# Altium schematic sheet S7V10Logger.SchDoc
size A3
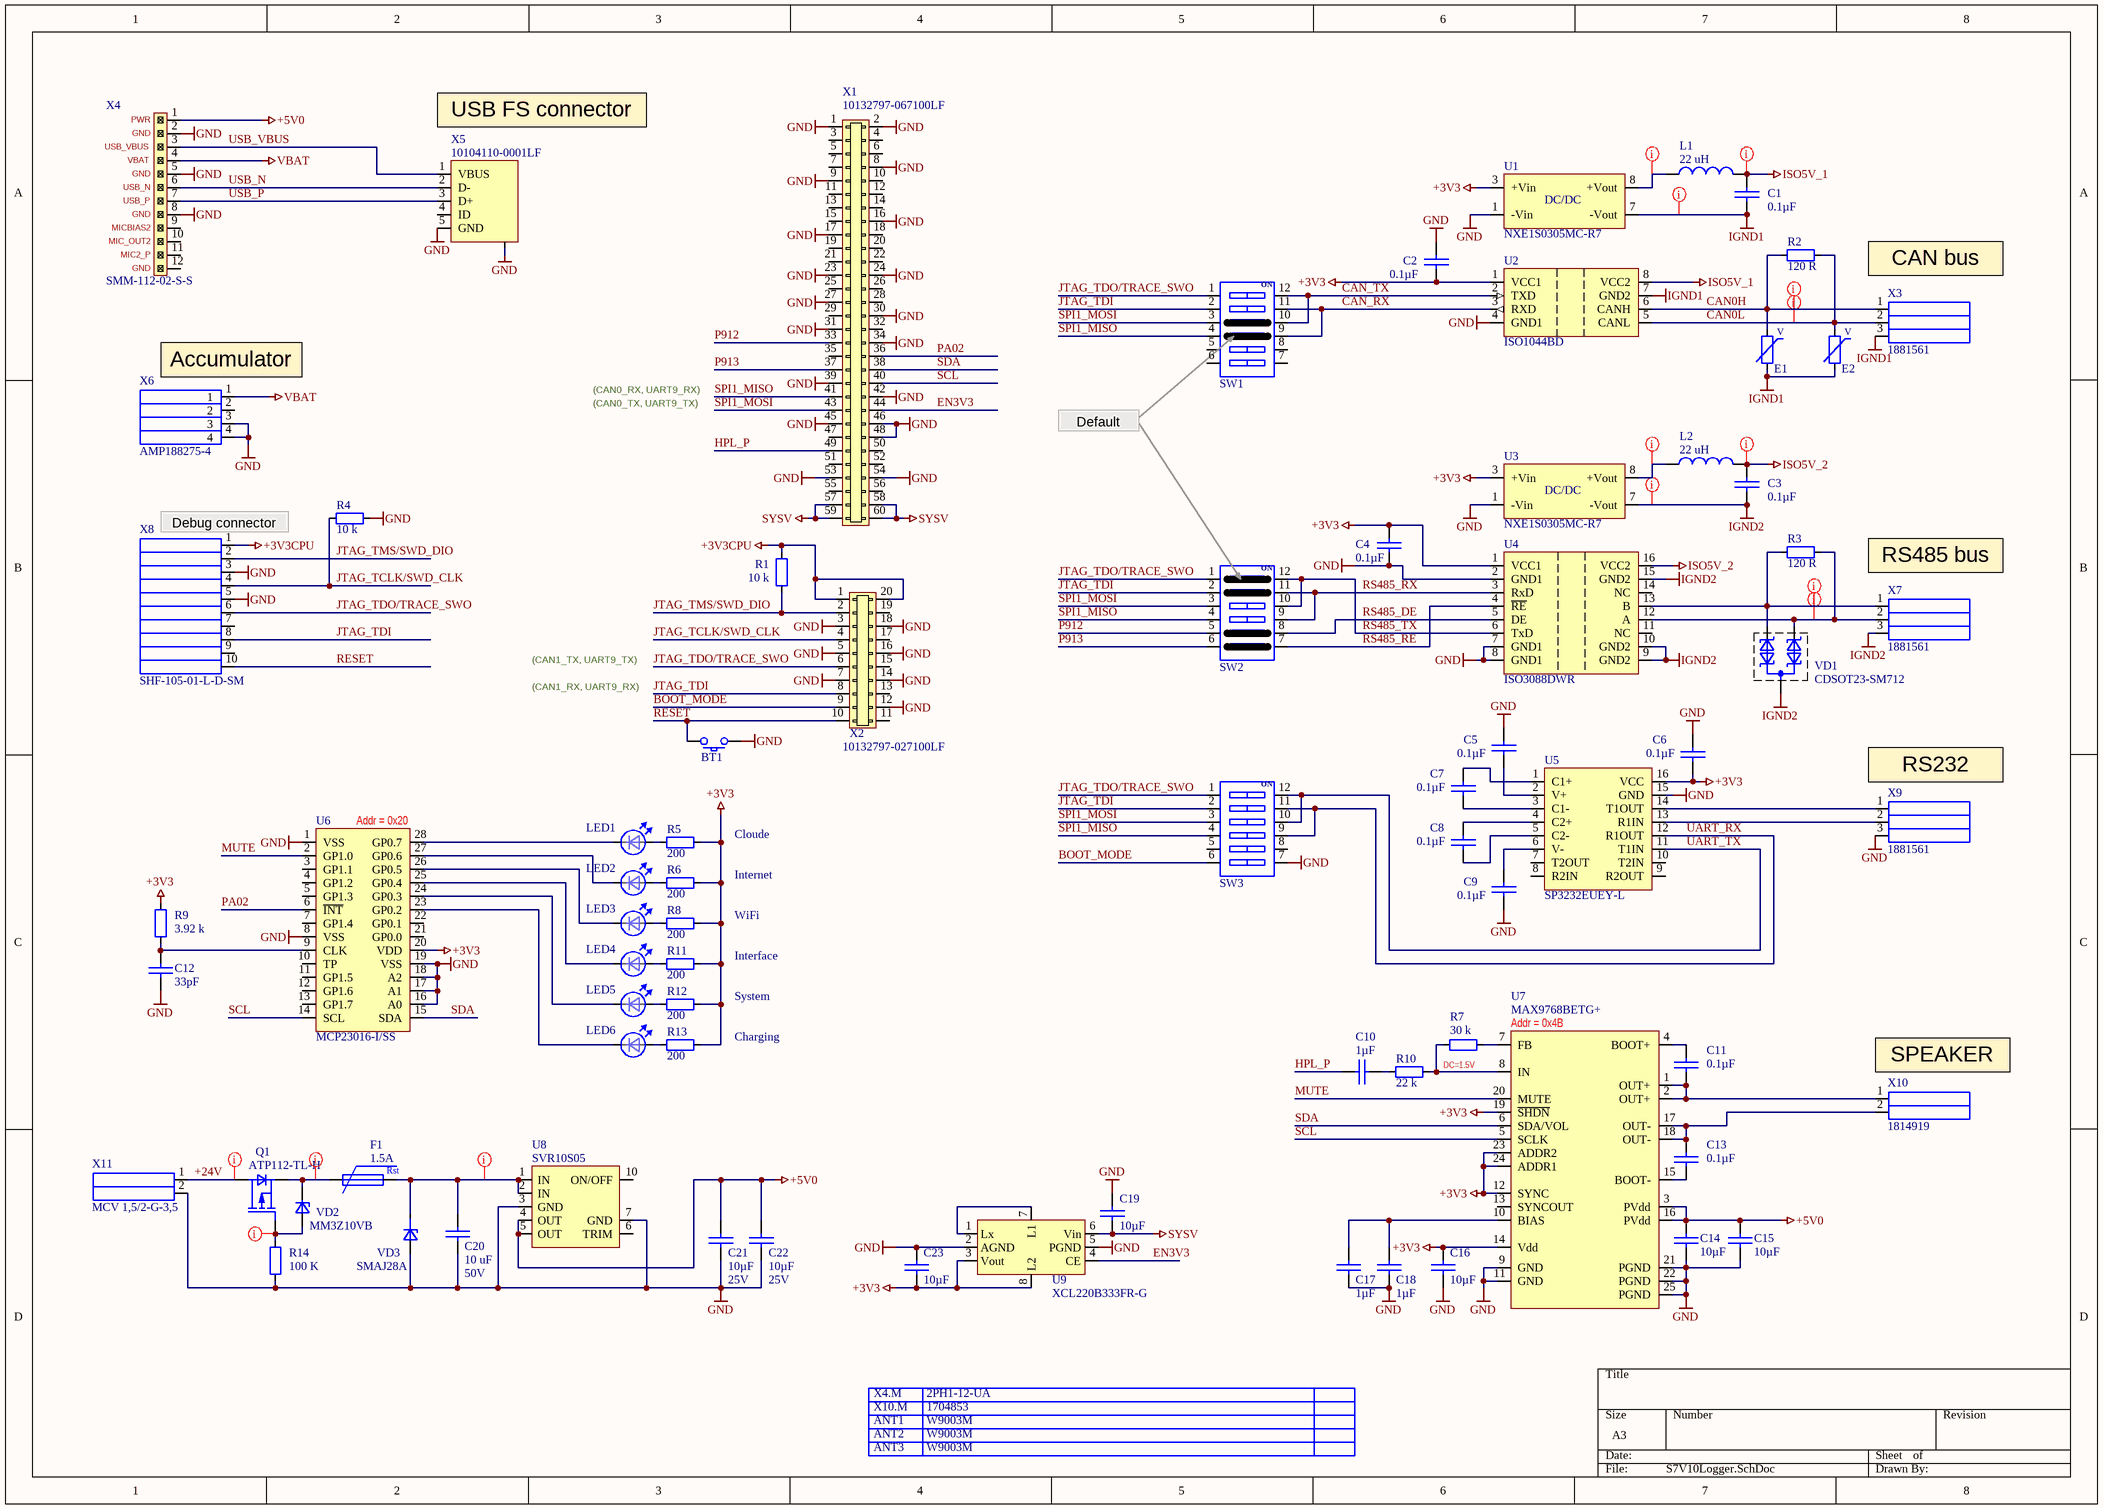
[diagram p0: S7V10Logger.SchDoc]

## Parts
ANT1  W9003M
ANT2  W9003M
ANT3  W9003M
BT1  B3U-3000P  [B3U-3000P]  (value not drawn)
C1  value 0.1µF  [0603 CAP]  (hidden comment: CL10B104KA8NNND)
C2  value 0.1µF  [0603 CAP]  (hidden comment: CL10B104KA8NNND)
C3  value 0.1µF  [0603 CAP]  (hidden comment: CL10B104KA8NNND)
C4  value 0.1µF  [0603 CAP]  (hidden comment: CL10B104KA8NNND)
C5  value 0.1µF  [0603 CAP]  (hidden comment: CL10B104KA8NNND)
C6  value 0.1µF  [0603 CAP]  (hidden comment: CL10B104KA8NNND)
C7  value 0.1µF  [0603 CAP]  (hidden comment: CL10B104KA8NNND)
C8  value 0.1µF  [0603 CAP]  (hidden comment: CL10B104KA8NNND)
C9  value 0.1µF  [0603 CAP]  (hidden comment: CL10B104KA8NNND)
C10  value 1µF  [0603 CAP]  (hidden comment: Capacitor)
C11  value 0.1µF  [0603 CAP]  (hidden comment: CL10B104KA8NNND)
C12  value 33pF  [0603 CAP]  (hidden comment: Capacitor)
C13  value 0.1µF  [0603 CAP]  (hidden comment: CL10B104KA8NNND)
C14  value 10µF  [0805 CAP]  (hidden comment: Capacitor)
C15  value 10µF  [0805 CAP]  (hidden comment: Capacitor)
C16  value 10µF  [0805 CAP]  (hidden comment: Capacitor)
C17  value 1µF  [0603 CAP]  (hidden comment: Capacitor)
C18  value 1µF  [0603 CAP]  (hidden comment: Capacitor)
C19  value 10µF  [0805 CAP]  (hidden comment: Capacitor)
C20  value 10 uF  Voltage: 50V  [3225[1210]]  (hidden comment: GRM32DF51H106ZA01L)
C21  value 10µF  Voltage - Rated: 25V  [1206 CAP]  (hidden comment: Capacitor)
C22  value 10µF  Voltage - Rated: 25V  [1206 CAP]  (hidden comment: Capacitor)
C23  value 10µF  [0805 CAP]  (hidden comment: Capacitor)
E1  823 560 505 60  [0603]  (value not drawn)
E2  823 560 505 60  [0603]  (value not drawn)
F1  value 1.5A  [2920 (7351 Metric)]  (hidden comment: 0ZCF0075AF2C)
L1  value 22 uH  [8200 Series Murata]  (hidden comment: 82223C)
L2  value 22 uH  [8200 Series Murata]  (hidden comment: 82223C)
LED1  SSL-LXA228SIC-TR31  [SSL-LXA228SIC-TR31]  (value not drawn)
LED2  SSL-LXA228SIC-TR31  [SSL-LXA228SIC-TR31]  (value not drawn)
LED3  SSL-LXA228SIC-TR31  [SSL-LXA228SIC-TR31]  (value not drawn)
LED4  SSL-LXA228SIC-TR31  [SSL-LXA228SIC-TR31]  (value not drawn)
LED5  SSL-LXA228SIC-TR31  [SSL-LXA228SIC-TR31]  (value not drawn)
LED6  SSL-LXA228SIC-TR31  [SSL-LXA228SIC-TR31]  (value not drawn)
Q1  ATP112-TL-H  [ATPAK, On Semiconductor]
R1  value 10 k  [0603]  (hidden comment: Resistor)
R2  value 120 R  [0603]  (hidden comment: RL0603E120-1)
R3  value 120 R  [0603]  (hidden comment: RL0603E120-1)
R4  value 10 k  [0603]  (hidden comment: Resistor)
R5  value 200  [0603]  (hidden comment: Resistor)
R6  value 200  [0603]  (hidden comment: Resistor)
R7  value 30 k  [0603]  (hidden comment: Resistor)
R8  value 200  [0603]  (hidden comment: Resistor)
R9  value 3.92 k  [0603]  (hidden comment: Resistor)
R10  value 22 k  [0603]  (hidden comment: Resistor)
R11  value 200  [0603]  (hidden comment: Resistor)
R12  value 200  [0603]  (hidden comment: Resistor)
R13  value 200  [0603]  (hidden comment: Resistor)
R14  value 100 K  [0603]  (hidden comment: RL0603K100-1)
SW1  CHS-06TA  [CHS-06TA Copal Electronics]  (value not drawn)
SW2  CHS-06TA  [CHS-06TA Copal Electronics]  (value not drawn)
SW3  CHS-06TA  [CHS-06TA Copal Electronics]  (value not drawn)
U1  NXE1S0305MC-R7  [NXE1 Murata]
U2  ISO1044BD  [SO-8]
U3  NXE1S0305MC-R7  [NXE1 Murata]
U4  ISO3088DWR  [SO-G16/D10.4]
U5  SP3232EUEY-L  [TSOP65P640-16AM]
U6  MCP23016-I/SS  [MICROCHIP_SSOP28_0.65_5.3]
U7  MAX9768BETG+  [THIN QFN 24 with via]
U8  SVR10S05  [SVR10S05]
U9  XCL220B333FR-G  [XCL219]
VD1  CDSOT23-SM712  [SOT23]
VD2  MM3Z10VB  [SOD323]
VD3  SMAJ28A  [SMA]
X1  10132797-067100LF  [10132797-067100LF]
X2  10132797-027100LF  [10132797-027100LF]
X3  1881561  [1881561]
X4  SMM-112-02-S-S  [SMM-112-02-S-S]
X4.M  2PH1-12-UA
X5  10104110-0001LF  [FCI micro USB B receptacle SMD]
X6  AMP188275-4  [AMP188275-4]
X7  1881561  [1881561]
X8  SHF-105-01-L-D-SM  [SHF-105-01-L-D-SM]
X9  1881561  [1881561]
X10  1814919  [1814919]
X10.M  1704853
X11  MCV 1,5/2-G-3,5  [mcv1.5-2-g_3.5 Green  + MC 1,5 2-ST-3,5 - 1840366]

## Nets
+3V3: C2.1 C4.2 C6.1 C16.1 C23.2 R5.2 R6.2 R8.2 R9.2 R11.2 R12.2 R13.2 U1.3(+Vin) U2.1(VCC1) U3.3(+Vin) U4.1(VCC1) U5.16(VCC) U6.20(VDD) U7.12(SYNC) U7.14(Vdd) U7.19(~{SHDN}) U7.23(ADDR2) U7.24(ADDR1) U9.3(Vout) U9.8(L2)
+3V3CPU: R1.2 X2.1 X2.20 X8.1
+5V0: C14.1 C15.1 C21.1 C22.1 U7.3(PVdd) U7.16(PVdd) U8.4(OUT) U8.5(OUT) X4.1
GND: BT1.1 C2.2 C4.1 C5.2 C6.2 C9.1 C12.2 C14.2 C15.2 C16.2 C17.2 C18.2 C19.1 C20.2 C21.2 C22.2 C23.1 R4.2 R14.1 SW3.7 U1.1(-Vin) U2.4(GND1) U3.1(-Vin) U4.2(GND1) U4.7(GND1) U4.8(GND1) U5.15(GND) U6.1(VSS) U6.8(VSS) U6.16(A0) U6.17(A1) U6.18(A2) U6.19(VSS) U7.9(GND) U7.11(GND) U7.21(PGND) U7.22(PGND) U7.25(PGND) U8.3(GND) U8.7(GND) U9.2(AGND) U9.5(PGND) VD3.2 X1.1 X1.2 X1.8 X1.9 X1.16 X1.17 X1.23 X1.24 X1.27 X1.30 X1.31 X1.34 X1.39 X1.42 X1.45 X1.46 X1.48 X1.53 X1.54 X2.3 X2.5 X2.7 X2.12 X2.14 X2.16 X2.18 X4.2 X4.5 X4.8 X5.5(GND) X5.G1(CASE) X6.3 X6.4 X8.3 X8.5 X9.3 X11.2
IGND1: C1.1 E1.1 E2.1 U1.7(-Vout) U2.7(GND2) X3.3
IGND2: C3.1 U3.7(-Vout) U4.9(GND2) U4.10(GND2) U4.15(GND2) VD1.3 X7.3
ISO5V_1: C1.2 L1.2 U2.8(VCC2)
ISO5V_2: C3.2 L2.2 U4.16(VCC2)
SYSV: C19.2 U9.6(Vin) X1.57 X1.58 X1.59 X1.60
VBAT: X4.4 X6.1
+24V: Q1.4(D) X11.1
BOOT_MODE: SW3.6 X2.9
CAN0H: E1.2 R2.2 U2.6(CANH) X3.1
CAN0L: E2.2 R2.1 U2.5(CANL) X3.2
CAN_RX: SW1.9 SW1.11 U2.3(RXD)
CAN_TX: SW1.10 SW1.12 U2.2(TXD)
EN3V3: U9.4(CE) X1.44
HPL_P: C10.1 X1.49
JTAG_TCLK/SWD_CLK: R4.1 X2.4 X8.4
JTAG_TDI: SW1.2 SW2.2 SW3.2 X2.8 X8.8
JTAG_TDO/TRACE_SWO: SW1.1 SW2.1 SW3.1 X2.6 X8.6
JTAG_TMS/SWD_DIO: R1.1 X2.2 X8.2
MUTE: U6.2(GP1.0) U7.20(MUTE)
P912: SW2.5 X1.33
P913: SW2.6 X1.37
PA02: U6.6(~{INT}) X1.36
RESET: BT1.2 X2.10 X8.10
RS485_DE: SW2.8 U4.5(DE)
RS485_RE: SW2.7 U4.4(~{RE})
RS485_RX: SW2.9 SW2.11 U4.3(RxD)
RS485_TX: SW2.10 SW2.12 U4.6(TxD)
SCL: U6.14(SCL) U7.5(SCLK) X1.40
SDA: U6.15(SDA) U7.6(SDA/VOL) X1.38
SPI1_MISO: SW1.4 SW2.4 SW3.4 X1.41
SPI1_MOSI: SW1.3 SW2.3 SW3.3 X1.43
UART_RX: SW3.9 SW3.11 U5.12(R1OUT)
UART_TX: SW3.10 SW3.12 U5.11(T1IN)
USB_N: X4.6 X5.2(D-)
USB_P: X4.7 X5.3(D+)
USB_VBUS: X4.3 X5.1(VBUS)
NetC5_1: C5.1 U5.2(V+)
NetC7_1: C7.1 U5.3(C1-)
NetC7_2: C7.2 U5.1(C1+)
NetC8_1: C8.1 U5.5(C2-)
NetC8_2: C8.2 U5.4(C2+)
NetC9_2: C9.2 U5.6(V-)
NetC10_2: C10.2 R10.1
NetC11_1: C11.1 U7.1(OUT+) U7.2(OUT+) X10.1
NetC11_2: C11.2 U7.4(BOOT+)
NetC12_1: C12.1 R9.1 U6.9(CLK)
NetC13_1: C13.1 U7.15(BOOT-)
NetC13_2: C13.2 U7.17(OUT-) U7.18(OUT-) X10.2
NetC17_1: C17.1 C18.1 U7.10(BIAS)
NetC20_1: C20.1 F1.2 U8.1(IN) U8.2(IN) VD3.1
NetF1_1: F1.1 Q1.3(S) VD2.2
NetL1_1: L1.1 U1.8(+Vout)
NetL2_1: L2.1 U3.8(+Vout)
NetLED1_1: LED1.1 R5.1
NetLED1_2: LED1.2 U6.28(GP0.7)
NetLED2_1: LED2.1 R6.1
NetLED2_2: LED2.2 U6.27(GP0.6)
NetLED3_1: LED3.1 R8.1
NetLED3_2: LED3.2 U6.26(GP0.5)
NetLED4_1: LED4.1 R11.1
NetLED4_2: LED4.2 U6.25(GP0.4)
NetLED5_1: LED5.1 R12.1
NetLED5_2: LED5.2 U6.24(GP0.3)
NetLED6_1: LED6.1 R13.1
NetLED6_2: LED6.2 U6.23(GP0.2)
NetQ1_1: Q1.1(G) R14.2 VD2.1
NetR3_1: R3.1 U4.12(A) VD1.1 X7.2
NetR3_2: R3.2 U4.13(B) VD1.2 X7.1
NetR7_1: R7.1 R10.2 U7.8(IN)
NetR7_2: R7.2 U7.7(FB)
NetU5_13: U5.13(R1IN) X9.2
NetU5_14: U5.14(T1OUT) X9.1
NetU9_1: U9.1(Lx) U9.7(L1)

Not connected (* = marked no-connect by the designer): SW1 5 6 7 8; SW3 5 8; U4 11(NC) 14(NC); U5 7(T2OUT) 8(R2IN) 9(R2OUT) 10(T2IN); U6 3(GP1.1) 4(GP1.2) 5(GP1.3) 7(GP1.4) 10(TP) 11(GP1.5) 12(GP1.6) 13(GP1.7) 21(GP0.0) 22(GP0.1); U7 13(SYNCOUT); U8 6(TRIM) 10(ON/OFF); X1 3(2) 4(3) 5(3) 6(4) 7(4) 10(6) 11(6) 12(7) 13(7) 14(8) 15(8) 18(10) 19(10) 20(11) 21(11) 22(12) 25(13) 26(14) 28(15) 29(15) 32(17) 35(18) 47(24) 50(26) 51(26) 52(27) 55(28) 56(29); X2 11(6) 13(7) 15(8) 17(9) 19(10); X4 9 10 11 12; X5 4(ID); X6 2; X8 7 9

## Layout directives
net class 24V: +24V, NetC20_1, NetF1_1, NetQ1_1
net class Isol1: CAN0H, CAN0L, IGND1, ISO5V_1, NetL1_1
net class Isol2: IGND2, ISO5V_2, NetL2_1, NetR3_1, NetR3_2

## Notes on the sheet
- (near X5) USB FS connector
- CAN bus
- (near X6) Accumulator
- (CAN0_RX, UART9_RX)
- (CAN0_TX, UART9_TX)
- Default state
- (near X8) Debug connector
- RS485 bus
- (CAN1_TX, UART9_TX)
- (CAN1_RX, UART9_RX)
- (near X9) RS232
- (near U6) Addr = 0x20
- Cloude
- Internet
- WiFi
- Interface
- System
- Charging
- (near U7) Addr = 0x4B
- DC=1.5V
- (near X10) SPEAKER
- (in symbol 0ZCF0075AF2C) Rst
- (in symbol 823 560 501 01) V
- (in symbol CHS-06TA) ON
- (in symbol NXE1S0305MC-R7) DC/DC
- (in symbol SMM-112-02-S-S) PWR; GND; USB_VBUS; VBAT; USB_N; USB_P; MICBIAS2; MIC_OUT2; MIC2_P

## Library data of the parts
ANT1-ANT3 = BOM item: CBL ASSY SMA-UMCC JACK-I-PEX 3"; Manufacturer: PulseLarsen Antennas; PartNum: 1837-1025-ND; Distributor: Digi-Key; PartName: W9003M
BT1 = B3U-3000P: Tactile Switch SPST-NO Side Actuated Surface Mount, Right Angle; Manufacturer: Omron Electronics Inc-EMC Div; PartNum: SW1022CT-ND; Distributor: Digi-Key; Price: 1$; PartName: B3U-3000P
C1-C9 C11 C13 = CL10B104KO8NNNC: 0.1µF, ±10%, 16V, X7R, 0603 (1608 Metric), -55°C ~ 125°C, -, General Purpose; Manufacturer: Samsung Electro-Mechanics; PartNum: 1276-1005-1-ND; Tolerance: ±10%; Distributor: Digi-Key; Price: 0.01480; PartName: CL10B104KO8NNNC; Voltage - Rated: 16V; Part Number: CL10B104KO8NNNC; Temperature Coefficient: X7R; Operating Temperature: -55°C ~ 125°C; Features: -; Package / Case: 0603 (1608 Metric)
C10 C17 C18 = CL10A105MP8NNNC: 1µF, ±20%, 10V, X5R, 0603 (1608 Metric), -55°C ~ 85°C, -, General Purpose; Manufacturer: Samsung Electro-Mechanics; PartNum: 1276-1866-1-ND; Part Number: CL10A105MP8NNNC; Distributor: Digi-Key; PartName: CL10A105MP8NNNC; Price: 0.01550; Tolerance: ±20%; Voltage - Rated: 10V; Temperature Coefficient: X5R; Operating Temperature: -55°C ~ 85°C; Features: -; Package / Case: 0603 (1608 Metric)
C12 = 885012006035: 33pF, ±5%, 25V, C0G, NP0, 0603 (1608 Metric), -55°C ~ 125°C, -, General Purpose; Manufacturer: Wurth Electronics Inc.; PartNum: 732-7777-1-ND; Part Number: 885012006035; Distributor: Digi-Key; PartName: 885012006035; Price: 0.02440; Tolerance: ±5%; Voltage - Rated: 25V; Temperature Coefficient: C0G, NP0; Operating Temperature: -55°C ~ 125°C; Features: -; Package / Case: 0603 (1608 Metric)
C14-C16 C19 C23 = EMK212ABJ106MG-T: 10µF, ±20%, 16V, X5R, 0805 (2012 Metric), -55°C ~ 85°C, -, SMPS Filtering; Manufacturer: Taiyo Yuden; PartNum: 587-6005-1-ND; Part Number: EMK212ABJ106MG-T; Distributor: Digi-Key; PartName: EMK212ABJ106MG-T; Price: 0.22000; Tolerance: ±20%; Voltage - Rated: 16V; Temperature Coefficient: X5R; Operating Temperature: -55°C ~ 85°C; Features: -; Package / Case: 0805 (2012 Metric)
C20 = GRM32DF51H106ZA01L: 10uF, 50V, 20%, Y5V (F), 1210; Manufacturer: Taiyo Yuden; PartNum: 587-2225-2-ND; PartName: UMK325BJ106MM-T; Tolerance: 20%; Price: 0.16$; Distributor: Digi-Key
C21 C22 = CL31A106KAHNFNE: 10µF, ±10%, 25V, X5R, 1206 (3216 Metric), -55°C ~ 85°C, -, General Purpose; Manufacturer: Samsung Electro-Mechanics; PartNum: 1276-3038-1-ND; Part Number: CL31A106KAHNFNE; Distributor: Digi-Key; PartName: CL31A106KAHNFNE; Price: 0.09500; Tolerance: ±10%; Temperature Coefficient: X5R; Operating Temperature: -55°C ~ 85°C; Features: -; Package / Case: 1206 (3216 Metric)
E1 E2 = 823 560 501 01: SUPPRESSOR ESD 5VDC, 56pF,  0603, -40..+85C; Manufacturer: Würth Elektronik; Voltage: 5V; Distributor: Würth Elektronik; PartNum: 823 560 505 60; PartName: 823 560 505 60
F1 = 0ZCF0075AF2C: PTC RESETTABLE 60V 750MA, It=1.5A, 0.3s 2920(7351); Manufacturer: Bel Fuse Inc.; PartNum: 507-1743-1-ND; Distributor: Digi-Key; PartName: 0ZCF0075AF2C
L1 L2 = 82223C: 22uH, 320 mA, 0.92 Ohm, +-10%,- 40..85 C; Manufacturer: TDK Corporation; PartNum: 811-2475-1-ND; Tolerance: ±10%; Distributor: Mouser; PartName: 82223C
LED1-LED6 = SSL-LXA228SIC-TR31: LED RED CLEAR 2SMD REV, 20mA, 2V, 475 mcd, 1.9 mm; Manufacturer: EVERLIGHT; PartNum: 67-2243-1-ND; Price: 0.11 Euro; PartName: SSL-LXA228SIC-TR31
Q1 = ATP112-TL-H: P-Channel MOSFET, –25 A, –20 V, RDS(ON) = 0.04,  VGS = –10 V; Manufacturer: ON Semiconductor; PartNum: ATP112-TL-HOSCT-ND; Distributor: Digi-Key; Price: 0.87$; PartName: ATP112-TL-H
R1 R4 = CR0603-FX-1002GLF: 10 kOhms, ±1%, 0.1W, 1/10W, Thick Film, ±100ppm/°C, 0603 (1608 Metric), -55°C ~ 155°C, Moisture Resistant; Manufacturer: Bourns Inc.; PartNum: CR0603-FX-1002GLFCT-ND; Voltage: 75V; Distributor: Digi-Key; Price: 0.00860; Tolerance: ±1%; PartName: CR0603-FX-1002GLF; Part Number: CR0603-FX-1002GLF; Temperature Coefficient: ±100ppm/°C; Operating Temperature: -55°C ~ 155°C; Power (Watts): 0.1W, 1/10W; Features: Moisture Resistant; Package / Case: 0603 (1608 Metric)
R2 R3 = RL0603E120-1: 120 R, 1%, 0603, SMD Resistor, Taped; Manufacturer: Vishay; Voltage: 75 V; Distributor: Schukat; Tolerance: ±1%; PartNum: RL0603E120; PartName: RL0603E120
R5 R6 R8 R11-R13 = RMCF0603FT200R: 200 Ohms, ±1%, 0.1W, 1/10W, Thick Film, ±100ppm/°C, 0603 (1608 Metric), -55°C ~ 155°C, Automotive AEC-Q200; Manufacturer: Stackpole Electronics Inc.; PartNum: RMCF0603FT200RCT-ND; Voltage: 75V; Distributor: Digi-Key; Price: 0.00690; Tolerance: ±1%; PartName: RMCF0603FT200R; Part Number: RMCF0603FT200R; Temperature Coefficient: ±100ppm/°C; Operating Temperature: -55°C ~ 155°C; Power (Watts): 0.1W, 1/10W; Features: Automotive AEC-Q200; Package / Case: 0603 (1608 Metric)
R7 = RMCF0603FT30K0: 30 kOhms, ±1%, 0.1W, 1/10W, Thick Film, ±100ppm/°C, 0603 (1608 Metric), -55°C ~ 155°C, Automotive AEC-Q200; Manufacturer: Stackpole Electronics Inc.; PartNum: RMCF0603FT30K0CT-ND; Voltage: 75V; Distributor: Digi-Key; Price: 0.00690; Tolerance: ±1%; PartName: RMCF0603FT30K0; Part Number: RMCF0603FT30K0; Temperature Coefficient: ±100ppm/°C; Operating Temperature: -55°C ~ 155°C; Power (Watts): 0.1W, 1/10W; Features: Automotive AEC-Q200; Package / Case: 0603 (1608 Metric)
R9 = RMCF0603FG3K92: 3.92 kOhms, ±1%, 0.1W, 1/10W, Thick Film, ±100ppm/°C, 0603 (1608 Metric), -55°C ~ 155°C, Automotive AEC-Q200; Manufacturer: Stackpole Electronics Inc.; PartNum: RMCF0603FG3K92CT-ND; Voltage: 75V; Distributor: Digi-Key; Price: 0.00690; Tolerance: ±1%; PartName: RMCF0603FG3K92; Part Number: RMCF0603FG3K92; Temperature Coefficient: ±100ppm/°C; Operating Temperature: -55°C ~ 155°C; Power (Watts): 0.1W, 1/10W; Features: Automotive AEC-Q200; Package / Case: 0603 (1608 Metric)
R10 = RMCF0603FG22K0: 22 kOhms, ±1%, 0.1W, 1/10W, Thick Film, ±100ppm/°C, 0603 (1608 Metric), -55°C ~ 155°C, Automotive AEC-Q200; Manufacturer: Stackpole Electronics Inc.; PartNum: RMCF0603FG22K0CT-ND; Voltage: 75V; Distributor: Digi-Key; Price: 0.00690; Tolerance: ±1%; PartName: RMCF0603FG22K0; Part Number: RMCF0603FG22K0; Temperature Coefficient: ±100ppm/°C; Operating Temperature: -55°C ~ 155°C; Power (Watts): 0.1W, 1/10W; Features: Automotive AEC-Q200; Package / Case: 0603 (1608 Metric)
R14 = RL0603K100-1: 100 K, 1%, 0603, SMD Resistor, Taped; Manufacturer: Vishay; Voltage: 75 V; Distributor: Schukat; Price: 0.002 Euro; Tolerance: 1%; PartNum: RL0603K100-1
SW1-SW3 = CHS-06TA: Dip Switch SPST 6 Position Surface Mount Slide (Standard) Actuator 100mA 6VDC; Manufacturer: Copal Electronics Inc.; PartNum: 563-1009-1-ND; Distributor: Digi-Key; PartName: CHS-06TA
U1 U3 = NXE1S0305MC-R7: DC/DC 3V In 5V Out, 200mA, 1W, 3kV, -40..+85 C,; Manufacturer: Murata Power Solutions Inc.; PartNum: 811-3099-1-ND; Distributor: Digi-Key; PartName: NXE1S0305MC-R7; Price: 3$
U2 = ISO1044BD: 1/1 Transceiver Full CAN, 5Mbps,  1.71V ~ 1.89V, 2.25V ~ 5.5V, 4.5V, -40°C ~ 125°C (TA), 8-SOIC (0.154", 3.90mm Width); Manufacturer: Texas Instruments; PartNum: 296-ISO1044BD-ND; Price: 4.13$; Distributor: Digi-Key; PartName: ISO1044BD
U4 = ISO3088DWR: RS422, RS485 Digital Isolator 2500Vrms, 20Mbps 25kV/µs CMTI 16-SOIC, -40°C ~ 85°C; Manufacturer: Texas Instruments; PartNum: 296-41274-1-ND; Distributor: Digi-Key; Price: 6$; PartName: ISO3088DWR
U5 = SP3232EUEY-L: IC TXRX RS232 ESD TRUE, 1 Mbps, -40+85C, 16TSSOP; Manufacturer: Exar Corporation; PartNum: 1016-1510-5-ND; Distributor: Digi-Key; Price: 1.5$; PartName: SP3232EUEY-L
U6 = MCP23016-I/SS: I2C 16-bit I/O Port Expander, 2..5.5 V, -40..+85 C; Manufacturer: Microchip; Price: 2$; Distributor: DigiKey
U7 = MAX9768BETG+: IC Audio amp, Class D 10W, mono,  4.5..14 V, -40..+85 C, 24-TQFN; Manufacturer: Maxim Integrated; PartNum: MAX9768BETG+-ND; Distributor: Digi-Key; Price: 2.85$; PartName: MAX9768BETG+
U8 = SVR10S05: Non-Isolated PoL Module DC DC Converter Output 5V 8V - Input, 1A, -40...+85 C; Manufacturer: XP Power; PartNum: 1470-SVR10S05-ND; Distributor: Digi-Key; price: 3.6$; PartName: SVR10S05
U9 = XCL220B333FR-G: Non-Isolated PoL Module DC DC Converter Output 3.3V - - 1A 2.5V - 5.5V Input, 1A, -40°C ~ 105°C,  (2.5mm x 2.0mm x 1.0mm); Manufacturer: Torex Semiconductor Ltd; PartNum: 893-1279-1-ND; price: 2.58$; Distributor: Digi-Key; PartName: XCL220B333FR-G
VD1 = CDSOT23-SM712: 26V, 14V Clamp 17A (8/20µs) Ipp Tvs Diode Surface Mount SOT-23-3; Manufacturer: Bourns Inc.; PartNum: CDSOT23-SM712CT-ND; Distributor: Digi-Key; Price: 1.46$; PartName: CDSOT23-SM712
VD2 = MM3Z10VB: Zener diode, 10V, 18 Ohm, 200mW, SOD-323F; Manufacturer: ON Semiconductor; PartNum: MM3Z10VBCT-ND; Price: 0.18$; Distributor: Digi-Key; PartName: MM3Z10VB; Voltage: 10V
VD3 = SMAJ28A: DIODE TVS 28V 400W UNI 5% SMD; Manufacturer: Bourns Inc.; PartNum: SMAJ28ABCT-ND; Distributor: Digi-Key; Price: 0.18$; PartName: SMAJ28A; Value: 28 V
X1 = 10132797-067100LF: 60 Position Connector Plug, Center Strip Contacts Surface Mount Gold; Manufacturer: Amphenol ICC (FCI); PartNum: 609-5229-1-ND; Distributor: Digi-Key; PartName: 10132797-067100LF
X2 = 10132797-027100LF: 20 Position Connector Plug, Outer Shroud Contacts Surface Mount Gold; Manufacturer: Amphenol ICC (FCI); PartNum: 609-5232-1-ND; Distributor: Digi-Key; PartName: 10132797-027100LF
X3 X7 X9 = 1881561: Printed-circuit board connector - MCV 0,5/ 3-G-2,5 - 1881561; Manufacturer: Phoenix Contact; Distributor: Phoenix Contact; Price: 0.33; PartNum: 1881561; PartName: MCV 0,5/ 3-G-2,5
X4 = SMM-112-02-S-S: 12 pins, 2 mm step; Manufacturer: Samtec Inc.; PartNum: SAM1244-12-ND; Distributor: Digi-Key; Price: 4.35$; PartName: SMM-112-02-S-S
X4.M = BOM item: Connector Header Through Hole 12 position 0.079" (2.00mm); Manufacturer: Adam Tech; PartNum: 2057-2PH1-12-UA-ND; Distributor: Digi-Key; PartName: 2PH1-12-UA
X5 = 10104110-0001LF: USB - micro B USB 2.0 Receptacle Connector 5 Position Surface Mount, Right Angle; Manufacturer: Amphenol FCI; PartNum: 609-4052-1-ND; Distributor: Digi-Key; Price: 0.79$; PartName: 10104110-0001LF
X6 = AMP188275-4: SMD Connector Female 4-Pole; Manufacturer: AMP; PartNum: A99473CT-ND; Distributor: Digi-Key; Price: 0.98$; PartName: AMP188275-4; Price50: 0.78$; Price100: 0.74$; Price1000: 0.68$
X8 = SHF-105-01-L-D-SM: 10 Positions Header Connector 0.050" (1.27mm) Surface Mount Gold; Manufacturer: Samtec Inc.; PartNum: SAM14533CT-ND; PartName: SHF-105-01-L-D-SM-TR; Distributor: Digi-Key
X10 = 1814919: SSL Connector Position Header, Male Pins Board to Cable/Wire 0.098" (2.50mm) Solder; Manufacturer: Phoenix Contact; PartNum: 277-9963-1-ND; Distributor: Digi-Key; PartName: 1814919
X10.M = BOM item: SSL Connector Position Plug, Female Sockets Board to Cable/Wire 0.098" (2.50mm) Spring-Cage; Manufacturer: Phoenix Contact; PartNum: 277-9949-ND; Distributor: Digi-Key; PartName: 1704853
X11 = MCV 1,5/2-G-3,5: HEADER, VERTICAL, 3.5MM, 2WAY; Manufacturer: PHOENIX CONTACT; PartNum: 1843606; Distributor: Farnell; PartName: MCV 1,5/2-G-3,5